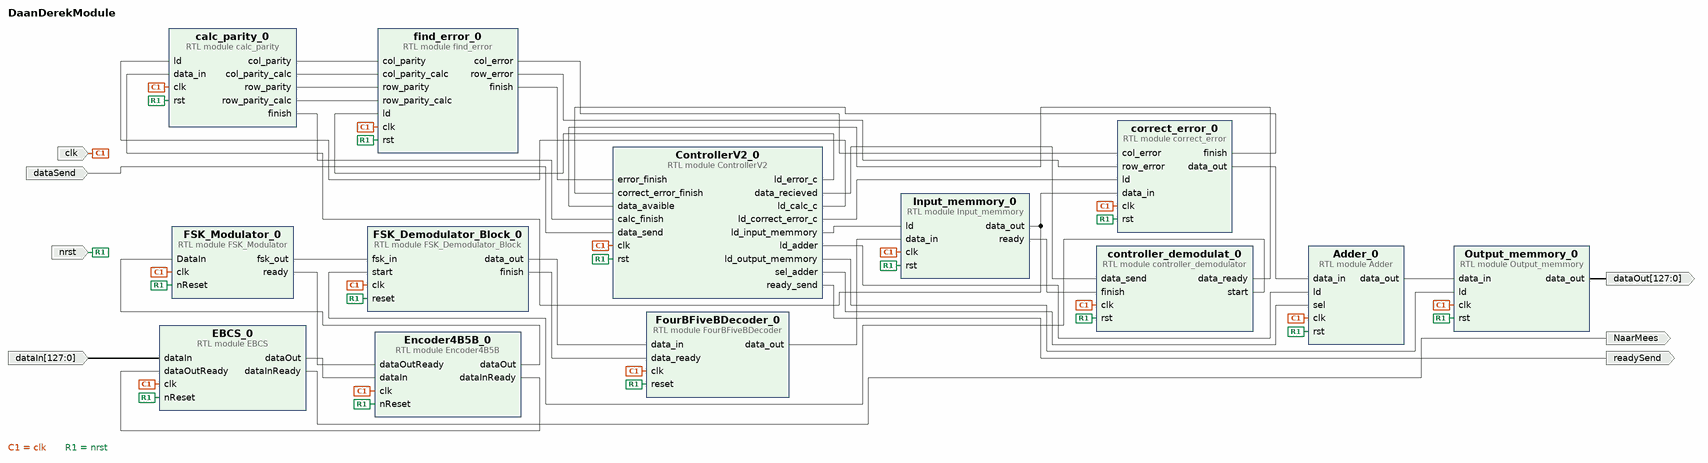
[diagram p0: block diagram of the top level]
# Vivado block design DaanDerekModule, xc7z020clg400-1, Vivado 2023.1
create_bd_design DaanDerekModule

create_bd_port -dir I clk
create_bd_port -dir I nrst
create_bd_port -dir O NaarMees
create_bd_port -dir O -from 127 -to 0 dataOut
create_bd_port -dir I dataSend
create_bd_port -dir O readySend
create_bd_port -dir I -from 127 -to 0 dataIn

create_bd_cell -type module -reference Encoder4B5B Encoder4B5B_0
create_bd_cell -type module -reference FSK_Modulator FSK_Modulator_0
create_bd_cell -type module -reference ControllerV2 ControllerV2_0
create_bd_cell -type module -reference Output_memmory Output_memmory_0
create_bd_cell -type module -reference calc_parity calc_parity_0
create_bd_cell -type module -reference Adder Adder_0
create_bd_cell -type module -reference correct_error correct_error_0
create_bd_cell -type module -reference EBCS EBCS_0
create_bd_cell -type module -reference controller_demodulator controller_demodulat_0
create_bd_cell -type module -reference Input_memmory Input_memmory_0
create_bd_cell -type module -reference FourBFiveBDecoder FourBFiveBDecoder_0
create_bd_cell -type module -reference FSK_Demodulator_Block FSK_Demodulator_Block_0
create_bd_cell -type module -reference find_error find_error_0

# ---- connections ----

connect_bd_net [get_bd_pins Adder_0/data_out] [get_bd_pins Output_memmory_0/data_in]
connect_bd_net [get_bd_pins ControllerV2_0/data_recieved] [get_bd_pins controller_demodulat_0/data_send]
connect_bd_net [get_bd_pins ControllerV2_0/ld_adder] [get_bd_pins Adder_0/ld]
connect_bd_net [get_bd_pins ControllerV2_0/ld_calc_c] [get_bd_pins calc_parity_0/ld]
connect_bd_net [get_bd_pins ControllerV2_0/ld_correct_error_c] [get_bd_pins correct_error_0/ld]
connect_bd_net [get_bd_pins ControllerV2_0/ld_error_c] [get_bd_pins find_error_0/ld]
connect_bd_net [get_bd_pins ControllerV2_0/ld_input_memmory] [get_bd_pins Input_memmory_0/ld]
connect_bd_net [get_bd_pins ControllerV2_0/ld_output_memmory] [get_bd_pins Output_memmory_0/ld]
connect_bd_net [get_bd_pins ControllerV2_0/ready_send] [get_bd_ports readySend]
connect_bd_net [get_bd_pins ControllerV2_0/sel_adder] [get_bd_pins Adder_0/sel]
connect_bd_net [get_bd_pins EBCS_0/dataInReady] [get_bd_ports NaarMees]
connect_bd_net [get_bd_pins EBCS_0/dataOut] [get_bd_pins Encoder4B5B_0/dataIn]
connect_bd_net [get_bd_pins Encoder4B5B_0/dataInReady] [get_bd_pins EBCS_0/dataOutReady]
connect_bd_net [get_bd_pins Encoder4B5B_0/dataOut] [get_bd_pins FSK_Modulator_0/DataIn]
connect_bd_net [get_bd_pins FSK_Demodulator_Block_0/data_out] [get_bd_pins FourBFiveBDecoder_0/data_in]
connect_bd_net [get_bd_pins FSK_Demodulator_Block_0/finish] [get_bd_pins FourBFiveBDecoder_0/data_ready]
connect_bd_net [get_bd_pins FSK_Modulator_0/fsk_out] [get_bd_pins FSK_Demodulator_Block_0/fsk_in]
connect_bd_net [get_bd_pins FSK_Modulator_0/ready] [get_bd_pins Encoder4B5B_0/dataOutReady]
connect_bd_net [get_bd_pins FourBFiveBDecoder_0/data_out] [get_bd_pins Input_memmory_0/data_in]
connect_bd_net [get_bd_pins Input_memmory_0/data_out] [get_bd_pins calc_parity_0/data_in] [get_bd_pins correct_error_0/data_in]
connect_bd_net [get_bd_pins Input_memmory_0/ready] [get_bd_pins controller_demodulat_0/finish]
connect_bd_net [get_bd_pins Output_memmory_0/data_out] [get_bd_ports dataOut]
connect_bd_net [get_bd_pins calc_parity_0/col_parity] [get_bd_pins find_error_0/col_parity]
connect_bd_net [get_bd_pins calc_parity_0/col_parity_calc] [get_bd_pins find_error_0/col_parity_calc]
connect_bd_net [get_bd_pins calc_parity_0/finish] [get_bd_pins ControllerV2_0/calc_finish]
connect_bd_net [get_bd_pins calc_parity_0/row_parity] [get_bd_pins find_error_0/row_parity]
connect_bd_net [get_bd_pins calc_parity_0/row_parity_calc] [get_bd_pins find_error_0/row_parity_calc]
connect_bd_net [get_bd_ports clk] \
  [get_bd_pins FSK_Modulator_0/clk] [get_bd_pins Encoder4B5B_0/clk] [get_bd_pins calc_parity_0/clk] \
  [get_bd_pins correct_error_0/clk] [get_bd_pins ControllerV2_0/clk] [get_bd_pins Output_memmory_0/clk] \
  [get_bd_pins Adder_0/clk] [get_bd_pins EBCS_0/clk] [get_bd_pins controller_demodulat_0/clk] \
  [get_bd_pins Input_memmory_0/clk] [get_bd_pins FourBFiveBDecoder_0/clk] [get_bd_pins FSK_Demodulator_Block_0/clk] \
  [get_bd_pins find_error_0/clk]
connect_bd_net [get_bd_pins controller_demodulat_0/data_ready] [get_bd_pins ControllerV2_0/data_avaible]
connect_bd_net [get_bd_pins controller_demodulat_0/start] [get_bd_pins FSK_Demodulator_Block_0/start]
connect_bd_net [get_bd_pins correct_error_0/data_out] [get_bd_pins Adder_0/data_in]
connect_bd_net [get_bd_pins correct_error_0/finish] [get_bd_pins ControllerV2_0/correct_error_finish]
connect_bd_net [get_bd_ports dataIn] [get_bd_pins EBCS_0/dataIn]
connect_bd_net [get_bd_ports dataSend] [get_bd_pins ControllerV2_0/data_send]
connect_bd_net [get_bd_pins find_error_0/col_error] [get_bd_pins correct_error_0/col_error]
connect_bd_net [get_bd_pins find_error_0/finish] [get_bd_pins ControllerV2_0/error_finish]
connect_bd_net [get_bd_pins find_error_0/row_error] [get_bd_pins correct_error_0/row_error]
connect_bd_net [get_bd_ports nrst] \
  [get_bd_pins FSK_Modulator_0/nReset] [get_bd_pins Encoder4B5B_0/nReset] [get_bd_pins calc_parity_0/rst] \
  [get_bd_pins correct_error_0/rst] [get_bd_pins Adder_0/rst] [get_bd_pins Output_memmory_0/rst] \
  [get_bd_pins ControllerV2_0/rst] [get_bd_pins EBCS_0/nReset] [get_bd_pins controller_demodulat_0/rst] \
  [get_bd_pins Input_memmory_0/rst] [get_bd_pins FourBFiveBDecoder_0/reset] [get_bd_pins FSK_Demodulator_Block_0/reset] \
  [get_bd_pins find_error_0/rst]

validate_bd_design
save_bd_design
